# Altium schematic sheet InverterConnector.SchDoc: Inverter Connector
size Letter; Engineer: Nathan Petersen; DocumentNumber: 18; Revision: v1.2; SheetNumber: 18; SheetTotal: 26
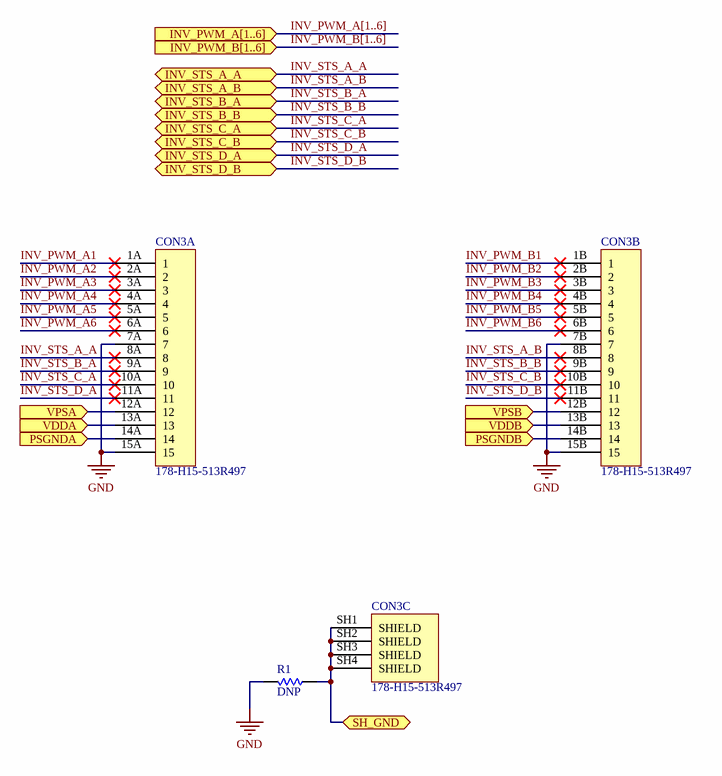
[diagram p0: InverterConnector.SchDoc]

## Parts
CON3  178-H15-513R497  [178-H15-513R497]  (parts A,B,C of 3)
R1  value DNP  [0603-RES]  (hidden comment: Resistor)

## Ports
INV_PWM_A[1..6] (in), INV_PWM_B[1..6] (in), INV_STS_A_A (bidir), INV_STS_A_B (bidir), INV_STS_B_A (bidir), INV_STS_B_B (bidir), INV_STS_C_A (bidir), INV_STS_C_B (bidir), INV_STS_D_A (bidir), INV_STS_D_B (bidir), PSGNDA (in), PSGNDB (in), SH_GND (bidir), VDDA (in), VDDB (in), VPSA (in), VPSB (in)

## Nets
GND: CON3.7A(7) CON3.7B(7) CON3.15A(15) CON3.15B(15) R1.2
INV_PWM_A1: CON3.1A(1)
INV_PWM_A2: CON3.2A(2)
INV_PWM_A3: CON3.3A(3)
INV_PWM_A4: CON3.4A(4)
INV_PWM_A5: CON3.5A(5)
INV_PWM_A6: CON3.6A(6)
INV_PWM_B1: CON3.1B(1)
INV_PWM_B2: CON3.2B(2)
INV_PWM_B3: CON3.3B(3)
INV_PWM_B4: CON3.4B(4)
INV_PWM_B5: CON3.5B(5)
INV_PWM_B6: CON3.6B(6)
INV_STS_A_A: CON3.8A(8) ; port INV_STS_A_A
INV_STS_A_B: CON3.8B(8) ; port INV_STS_A_B
INV_STS_B_A: CON3.9A(9) ; port INV_STS_B_A
INV_STS_B_B: CON3.9B(9) ; port INV_STS_B_B
INV_STS_C_A: CON3.10A(10) ; port INV_STS_C_A
INV_STS_C_B: CON3.10B(10) ; port INV_STS_C_B
INV_STS_D_A: CON3.11A(11) ; port INV_STS_D_A
INV_STS_D_B: CON3.11B(11) ; port INV_STS_D_B
PSGNDA: CON3.14A(14) ; port PSGNDA
PSGNDB: CON3.14B(14) ; port PSGNDB
SH_GND: CON3.SH1(SHIELD) CON3.SH2(SHIELD) CON3.SH3(SHIELD) CON3.SH4(SHIELD) R1.1 ; port SH_GND
VDDA: CON3.13A(13) ; port VDDA
VDDB: CON3.13B(13) ; port VDDB
VPSA: CON3.12A(12) ; port VPSA
VPSB: CON3.12B(12) ; port VPSB

## Buses and harness runs
bus INV_PWM_A[1..6] = port INV_PWM_A[1..6]
bus INV_PWM_B[1..6] = port INV_PWM_B[1..6]

## Notes on the sheet
- Title:
- File:
- Sheet:
- of
- Revision:
- Time:
- Date:
- Engineer:

## Library data of the parts
CON3 = 178-H15-513R497: CONN D-SUB RCPT/RCPT 15/15POS RA; Supplier 1: Digi-Key; Supplier Part Number 1: NOR1832-ND
R1 = Resistor: Supplier 1: Digi-Key; Supplier Part Number 1: P0.0GCT-ND